# EAGLE design defmon (EAGLE 6.3)
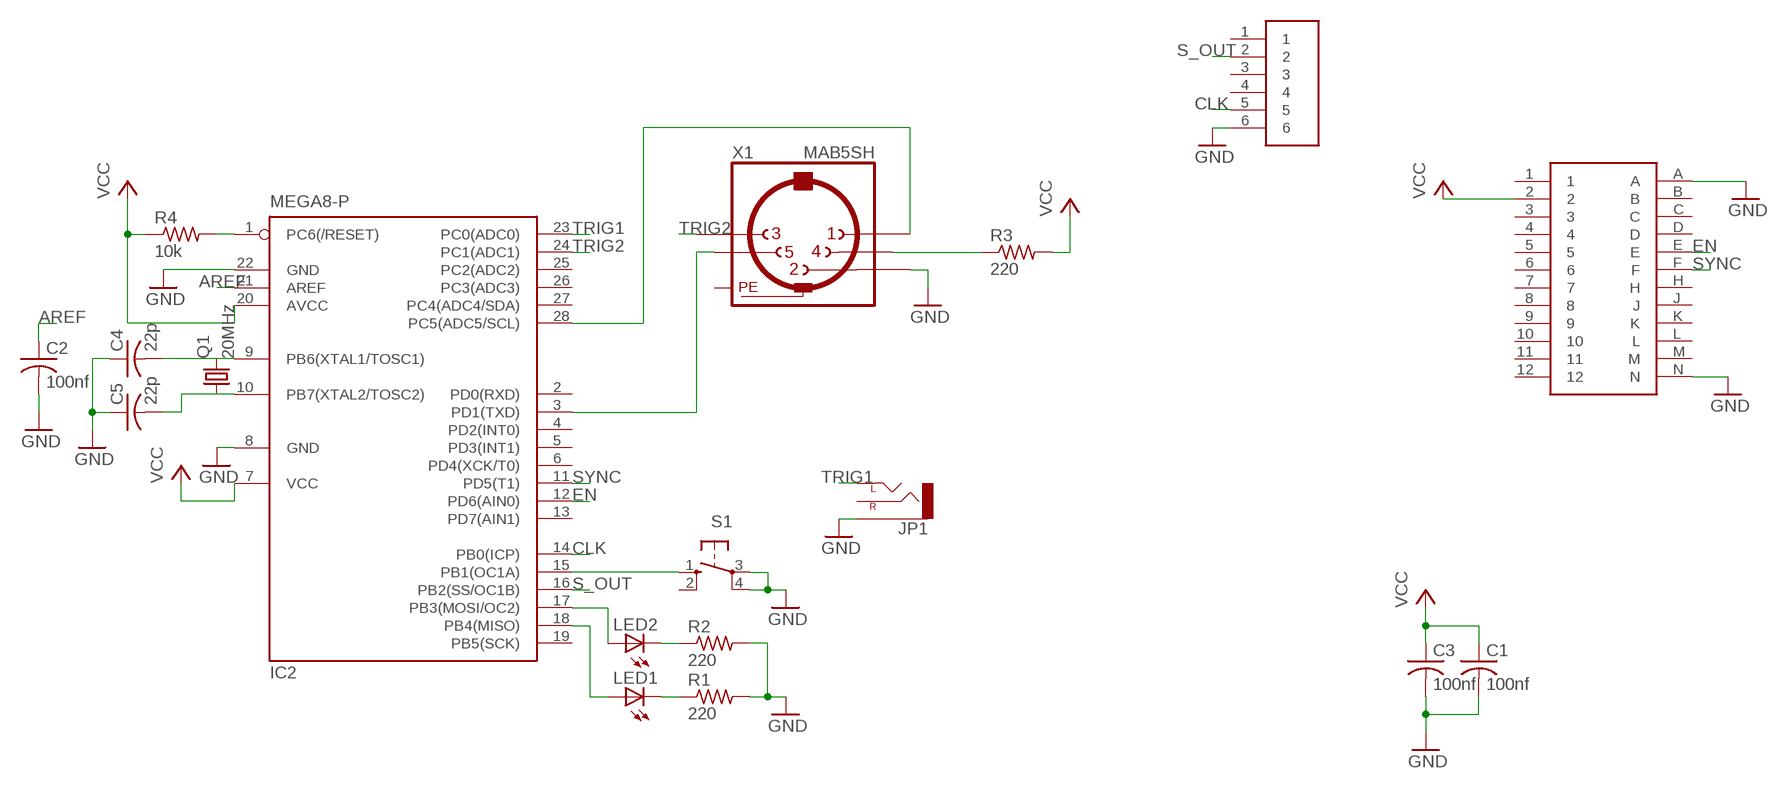
[diagram p0: schematic, sheet 1]

## Parts
C1  100nf  C-US025-025X050  [C025-025X050]
C2  100nf  C-US025-025X050  [C025-025X050]
C3  100nf  C-US025-025X050  [C025-025X050]
C4  22p  C-US025-025X050  [C025-025X050]
C5  22p  C-US025-025X050  [C025-025X050]
IC2  MEGA8-P  [DIL28-3]
JP1  AUDIO-JACKPTH  [AUDIO-JACK]
LED1  LED3MM  [LED3MM]
LED2  LED3MM  [LED3MM]
Q1  20MHz  CRYSTALHC49U-V  [HC49U-V]
R1  220  R-US_0204/7  [0204/7]
R2  220  R-US_0204/7  [0204/7]
R3  220  R-US_0204/7  [0204/7]
R4  10k  R-US_0204/7  [0204/7]
S1  40-XX  [B3F-40XX]
U$1  GB  [GB]
U$2  C64U  [C64U]
X1  MAB5SH  [MAB5SH]

## Nets
AREF: C2.1 IC2.21(AREF)
CLK: IC2.14(PB0(ICP)) U$1.5
EN: IC2.12(PD6(AIN0)) U$2.E
GND: C1.2 C2.2 C3.2 C4.1 C5.1 IC2.8(GND) IC2.22(GND) JP1.SLEEVE R1.2 R2.2 S1.3(P) S1.4(P1) U$1.6 U$2.A U$2.N X1.2
N$1: LED2.K(C) R2.1
N$2: LED1.K(C) R1.1
N$3: R3.1 X1.4
N$4: IC2.15(PB1(OC1A)) S1.1(S)
N$5: IC2.17(PB3(MOSI/OC2)) LED2.A
N$6: IC2.18(PB4(MISO)) LED1.A
N$8: C4.2 IC2.9(PB6(XTAL1/TOSC1)) Q1.2
N$9: IC2.28(PC5(ADC5/SCL)) X1.1
N$10: C1.1 C3.1 IC2.7(VCC) IC2.20(AVCC) R3.2 R4.1 U$2.2 ; supply symbol labelled VCC
N$11: C5.2 IC2.10(PB7(XTAL2/TOSC2)) Q1.1
N$12: IC2.1(PC6(/RESET)) R4.2
N$13: IC2.3(PD1(TXD)) X1.5
S_OUT: IC2.16(PB2(SS/OC1B)) U$1.2
SYNC: IC2.11(PD5(T1)) U$2.F
TRIG1: IC2.23(PC0(ADC0)) JP1.TIP(LEFT)
TRIG2: IC2.24(PC1(ADC1)) X1.3
Unconnected: IC2.2(PD0(RXD)) IC2.4(PD2(INT0)) IC2.5(PD3(INT1)) IC2.6(PD4(XCK/T0)) IC2.13(PD7(AIN1)) IC2.19(PB5(SCK)) IC2.25(PC2(ADC2)) IC2.26(PC3(ADC3)) IC2.27(PC4(ADC4/SDA)) JP1.RING(RIGHT) S1.2(S1) U$1.1 U$1.3 U$1.4 U$2.1 U$2.3 U$2.4 U$2.5 U$2.6 U$2.7 U$2.8 U$2.9 U$2.10 U$2.11 U$2.12 U$2.B U$2.C U$2.D U$2.H U$2.J U$2.K U$2.L U$2.M

## Power pins joined to a net without a drawn wire
PE: X1.PE X1.PE@(PE)

## Library data of the parts
C1-C5 = rcl:C-US: CAPACITOR, American symbol
IC2 = atmel:MEGA8-P: MICROCONTROLLER 8 Kbytes FLASH, 1 kbytes SRAM, 512 bytes EEPROM, USART, 4-channel 10 bit ADC, 2-channel 8 bit ADC Pin compatible with Atmega48, ATMega88, ATMega168 Source: avr.lbr; OC_FARNELL: unknown; OC_NEWARK: unknown
JP1 = SparkFun-Connectors:AUDIO-JACK: 3.5mm Audio Jack Simple 3.5mm common PCB mount audio jack. Variant PTH is our storefront SKU PRT-08032
LED1 LED2 = led:LED: LED OSRAM: - CHIPLED LG R971, LG N971, LY N971, LG Q971, LY Q971, LO R971, LY R971 LH N974, LH R974 LS Q976, LO Q976, LY Q976 LO Q996 - Hyper CHIPLED LW Q18S LB Q993, LB Q99A, LB R99A - SideLED LS A670, LO A670, LY A670, LG A670, LP A670 LB A673, LV A673, LT A673, LW A673 LH A674 LY A675 LS A676, LA A676, LO A676, LY A676, LW A676 LS A679, LY A679, LG A679 - Hyper Micro SIDELED® LS Y876, LA Y876, LO Y876, LY Y876 LT Y87S - SmartLED LW L88C, LW L88S LB L89C, LB L89S, LG L890 LS L89K, LO L89K, LY L89K LS L896, LA L896, LO L896, LY L896 - TOPLED LS T670, LO T670, LY T670, LG T670, LP T670 LSG T670, LSP T670, LSY T670, LOP T670, LYG T670 LG T671, LOG T671, LSG T671 LB T673, LV T673, LT T673, LW T673 LH T674 LS T676, LA T676, LO T676, LY T676, LB T676, LH T676, LSB T676, LW T676 LB T67C, LV T67C, LT T67C, LS T67K, LO T67K, LY T67K, LW E67C LS E67B, LA E67B, LO E67B, LY E67B, LB E67C, LV E67C, LT E67C LW T67C LS T679, LY T679, LG T679 LS T770, LO T770, LY T770, LG T770, LP T770 LB T773, LV T773, LT T773, LW T773 LH T774 LS E675, LA E675, LY E675, LS T675 LS T776, LA T776, LO T776, LY T776, LB T776 LHGB T686 LT T68C, LB T68C - Hyper Mini TOPLED® LB M676 - Mini TOPLED Santana® LG M470 LS M47K, LO M47K, LY M47K Source: http://www.osram.convergy.de LUXEON: - LUMILED® LXK2-PW12-R00, LXK2-PW12-S00, LXK2-PW14-U00, LXK2-PW14-V00 LXK2-PM12-R00, LXK2-PM12-S00, LXK2-PM14-U00 LXK2-PE12-Q00, LXK2-PE12-R00, LXK2-PE12-S00, LXK2-PE14-T00, LXK2-PE14-U00 LXK2-PB12-K00, LXK2-PB12-L00, LXK2-PB12-M00, LXK2-PB14-N00, LXK2-PB14-P00, LXK2-PB14-Q00 LXK2-PR12-L00, LXK2-PR12-M00, LXK2-PR14-Q00, LXK2-PR14-R00 LXK2-PD12-Q00, LXK2-PD12-R00, LXK2-PD12-S00 LXK2-PH12-R00, LXK2-PH12-S00 LXK2-PL12-P00, LXK2-PL12-Q00, LXK2-PL12-R00 Source: www.luxeon.com KINGBRIGHT: KA-3528ASYC Source: www.kingbright.com
Q1 = crystal:CRYSTAL: CRYSTAL; OC_FARNELL: 1666969; OC_NEWARK: unknown
R1-R4 = rcl:R-US_: RESISTOR, American symbol
S1 = switch-omron:40-XX: OMRON SWITCH; MF: OMRON COMPONENTS USA; MPN: B3F-4000; OC_FARNELL: 176434; OC_NEWARK: 36K3105
U$1 = connector:GB
U$2 = connector:C64U
X1 = con-hirschmann:MAB5SH: Female CONNECTOR 5 pins 90 deg. with shield, horizontal (DIN 41524); OC_FARNELL: 809883; OC_NEWARK: unknown

## Board
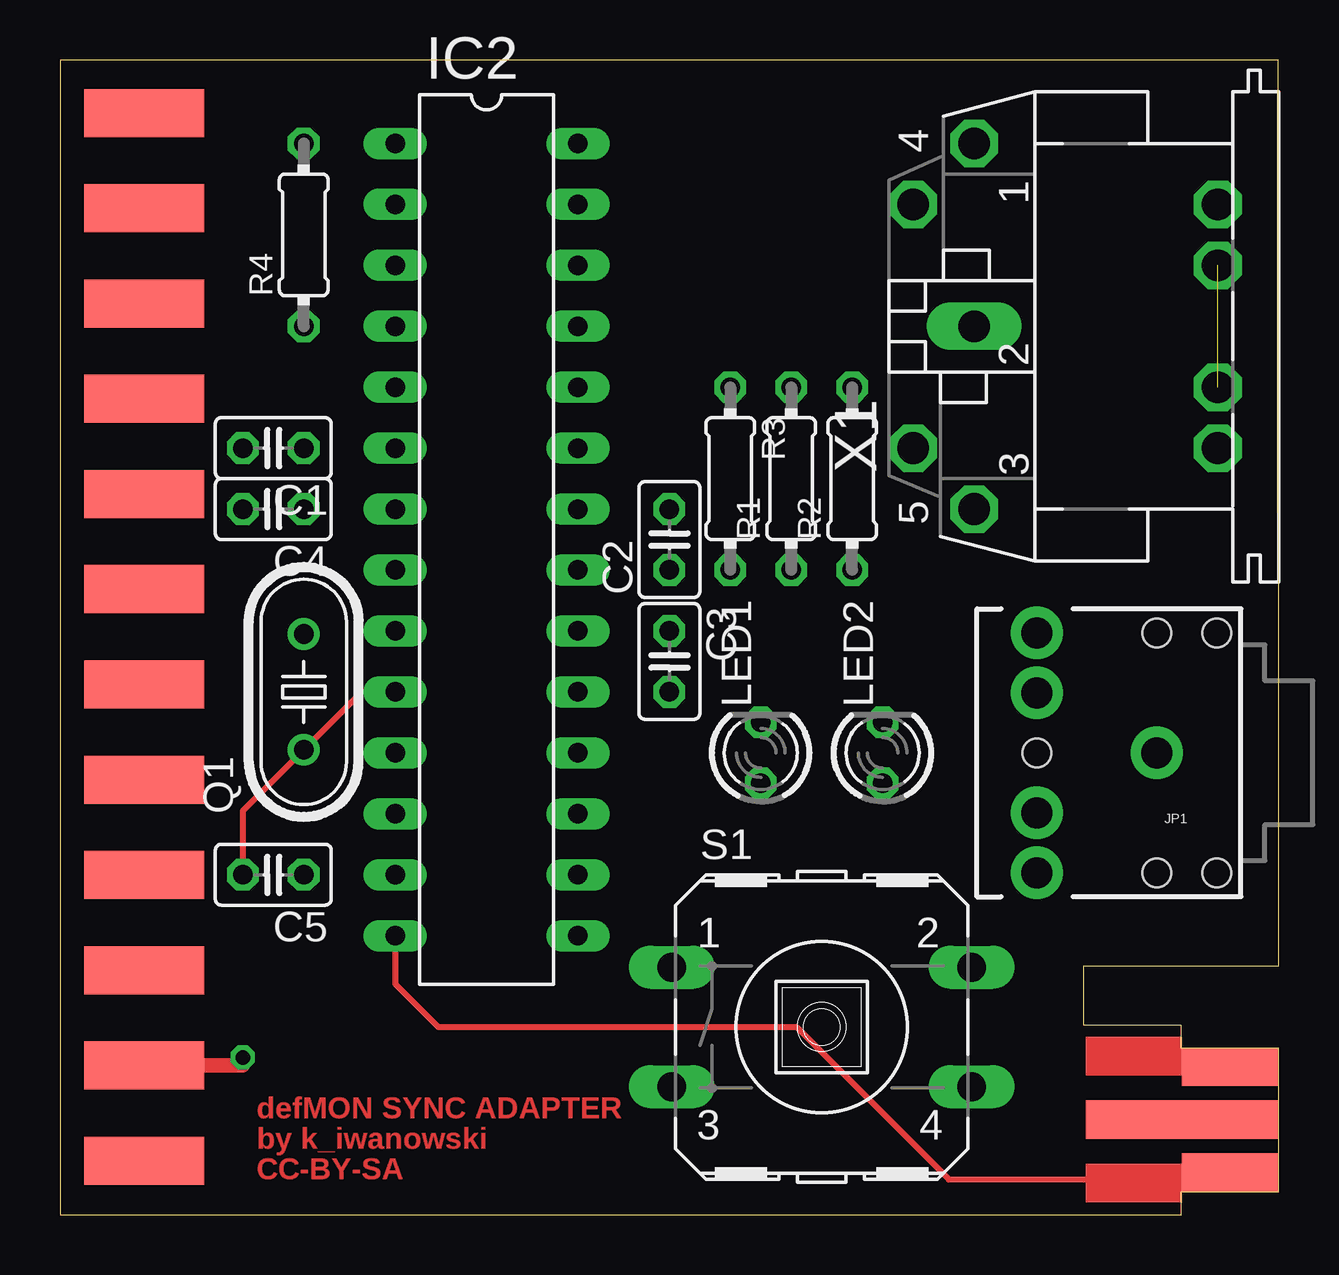
[diagram p1: board, top side]
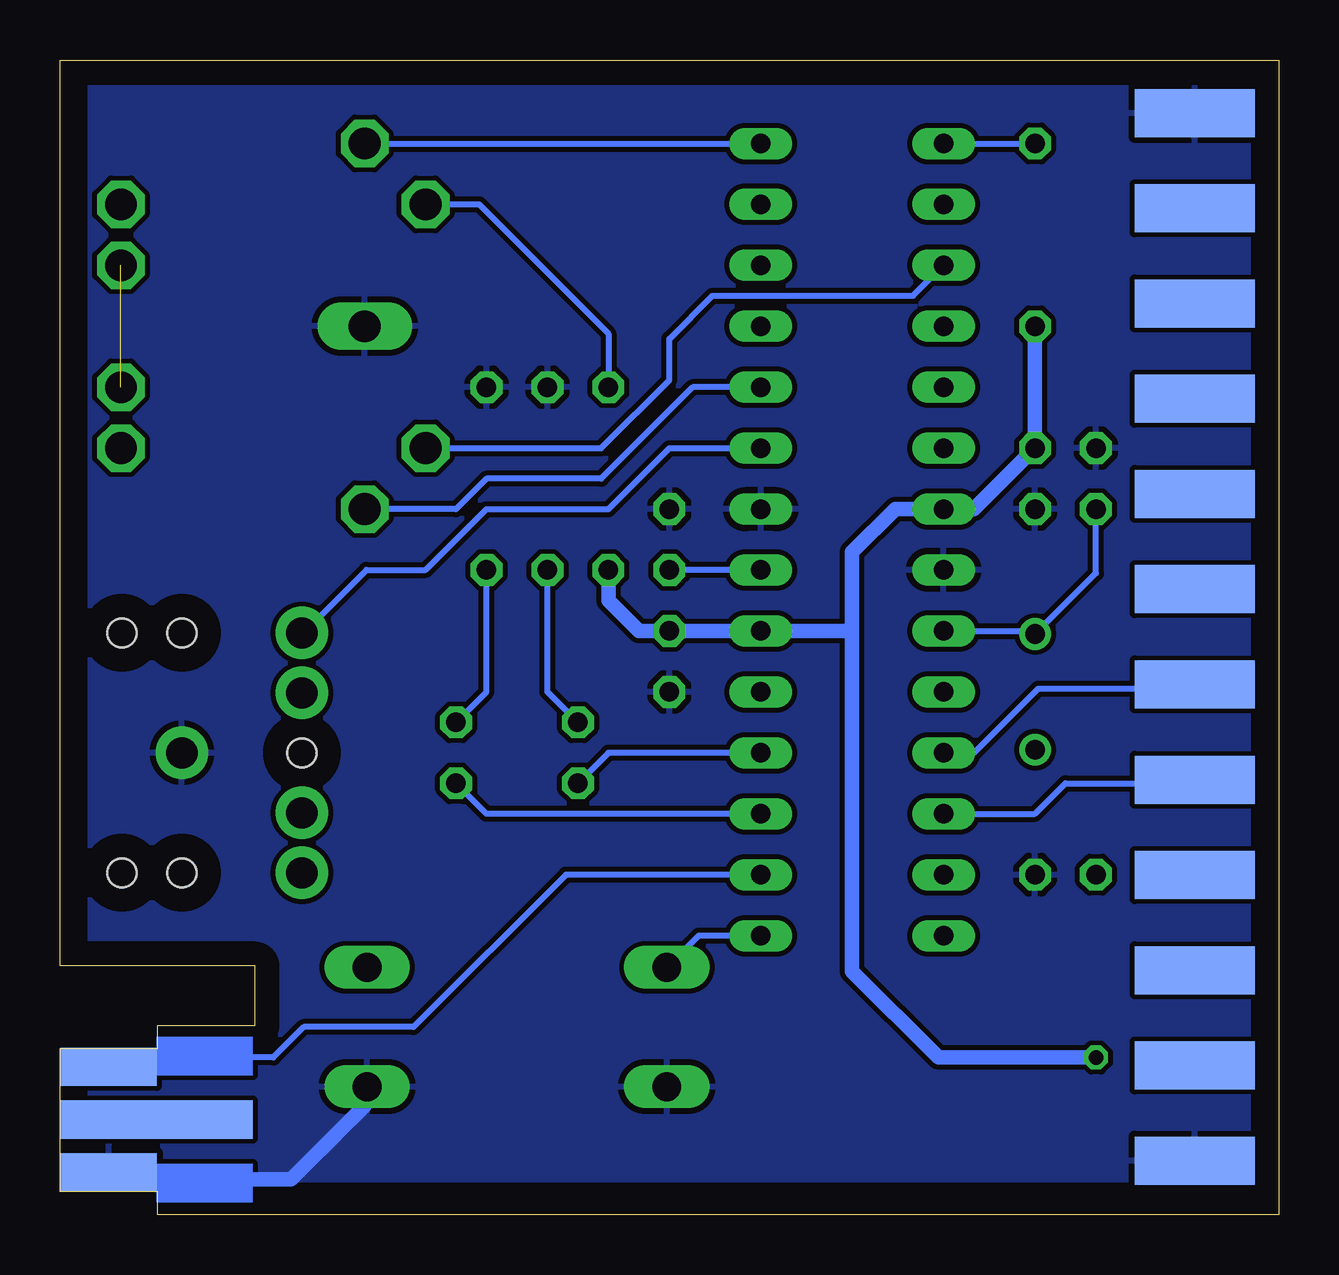
[diagram p2: board, bottom side, seen from below]

Size 50.8 x 48.13 mm. Coordinates in mm from the lower left corner, seen from the top.
Outline: 0,0 46.74,0 46.74,0.96 50.8,0.96 50.8,6.93 46.74,6.93 46.74,7.89 42.67,7.89 42.67,10.36 50.8,10.36 50.78,48.13 0,48.13 0,0
Copper layers (1*16): Top 0.035mm / dielectric 1.5mm / Bottom 0.035mm
Design rules "default": minimum track width 10mil, minimum drill 24mil, track to track 8mil, track to pad 8mil, pad to pad 8mil, via to via 8mil, smd to smd 8mil, copper to edge 40mil, drill to drill 8mil, minimum pad ring 10mil, minimum via ring 8mil, stop-mask expansion 4mil, vias tented up to drill 0mil, thermal gap 10mil

### Footprints (pad centres in the part's own frame; a part is rotated, then mirrored left to right if it is on the bottom)
C025-025X050 = drill 0.813 octagon: 1 -1.27,0; 2 1.27,0
DIL28-3 = drill 0.813 long: 1 -16.51,-3.81; 2 -13.97,-3.81; 3 -11.43,-3.81; 4 -8.89,-3.81; 5 -6.35,-3.81; 6 -3.81,-3.81; 7 -1.27,-3.81; 8 1.27,-3.81; 9 3.81,-3.81; 10 6.35,-3.81; 11 8.89,-3.81; 12 11.43,-3.81; 13 13.97,-3.81; 14 16.51,-3.81; 15 16.51,3.81; 16 13.97,3.81; 17 11.43,3.81; 18 8.89,3.81; 19 6.35,3.81; 20 3.81,3.81; 21 1.27,3.81; 22 -1.27,3.81; 23 -3.81,3.81; 24 -6.35,3.81; 25 -8.89,3.81; 26 -11.43,3.81; 27 -13.97,3.81; 28 -16.51,3.81
AUDIO-JACK = drill 1.3 pad 2.184: RING 5,5; RSH 5,2.5; SLEEVE 0,0; TIP 5,-5; TSH 5,-2.5 | hole 1.2: 0,5; -2.5,5; -2.5,-5; 0,-5; 5,0
LED3MM = drill 0.813 octagon: A -1.27,0; K 1.27,0
HC49U-V = drill 0.813: 1 -2.413,0; 2 2.413,0
0204/7 = drill 0.813 octagon: 1 -3.81,0; 2 3.81,0
B3F-40XX = drill 1.194 long: 1 -6.248,2.489; 2 6.248,2.489; 3 -6.248,-2.489; 4 6.248,-2.489
GB = smd 4 x 1.6: 1 0,5.2; 5 0,0.8 | smd 4 x 1.6 bottom: 2 0,5.2; 6 0,0.8 | smd 8 x 1.6: 3 -2,3 | smd 8 x 1.6 bottom: 4 -2,3
C64U = smd 5 x 2: 1 0,43.67; 2 0,39.7; 3 0,35.73; 4 0,31.76; 5 0,27.79; 6 0,23.82; 7 0,19.85; 8 0,15.88; 9 0,11.91; 10 0,7.94; 11 0,3.97; 12 0,0 | smd 5 x 2 bottom: A 0,43.67; B 0,39.7; C 0,35.73; D 0,31.76; E 0,27.79; F 0,23.82; H 0,19.85; J 0,15.88; K 0,11.91; L 0,7.94; M 0,3.97; N 0,0
MAB5SH = drill 1.321 octagon: 1 7.62,5.08; 3 -7.62,5.08; 4 5.08,7.62; 5 -5.08,7.62; PE -2.54,-5.08; PE1 -5.08,-5.08; PE2 5.08,-5.08; PE@ 2.54,-5.08 | drill 1.321 long: 2 0,5.08

### Placement (x,y rotation side)
C1  8.89,31.95 180 top
C2  25.4,28.14 90 top
C3  25.4,23.06 270 top
C4  8.89,29.41 180 top
C5  8.89,14.17 180 top
IC2  17.78,28.14 270 top
JP1  45.72,19.25 180 top
LED1  29.21,19.25 90 top
LED2  34.29,19.25 90 top
Q1  10.16,21.79 90 top
R1  30.48,30.68 90 top
R2  33.02,30.68 90 top
R3  27.94,30.68 270 top
R4  10.16,40.84 90 top
S1  31.75,7.82 0 top
U$1  48.77,0.96 0 top
U$2  3.5,45.92 180 top
X1  43.18,37.03 90 top

### Tracks (layer width: path | path; a pad name or v marks a point on that pad's centre or on a via)
AREF
  Bottom 0.254: IC2.21 C2.1
CLK
  Top 0.254: IC2.14 13.97,9.62 15.77,7.82 30.7,7.82 37.05,1.47 48.77,1.47 U$1.5
EN
  Bottom 0.254: IC2.12 10.16,16.71 8.89,17.98 3.81,17.98 U$2.E
GND
  Bottom 0.61: S1.4 38.1,5.33 38.1,4.54 41.17,1.47 48.77,1.47 U$1.6
  pour Bottom: 1.27,47.19 49.53,47.19 49.53,1.47 1.27,1.47
N$1
  Bottom 0.254: LED2.K 33.02,21.79 R2.1
N$2
  Bottom 0.254: LED1.K 30.48,21.79 R1.1
N$3
  Bottom 0.254: X1.4 33.33,42.11 27.94,36.72 R3.1
N$4
  Bottom 0.254: IC2.15 24.18,11.63 S1.1
N$5
  Bottom 0.254: IC2.17 33.02,16.71 LED2.A
N$6
  Bottom 0.254: IC2.18 27.94,19.25 LED1.A
N$8
  Bottom 0.254: IC2.9 10.16,24.33 Q1.2 7.62,26.74 C4.2
N$9
  Bottom 0.254: X1.1 IC2.28
N$10  (via drill 0.6)
  Top 0.61: U$2.2 7.62,6.22 v7.62,6.55
  Bottom 0.61: R3.2 27.94,25.6 26.67,24.33 C3.1 IC2.20 17.78,24.33 | 17.78,24.33 17.78,27.61 15.98,29.41 IC2.7 12.7,29.41 C1.1 R4.1 | v7.62,6.55 14.19,6.55 17.78,10.14 17.78,24.33
N$11
  Top 0.254: IC2.10 12.57,21.79 Q1.1 7.62,16.84 C5.2
N$12
  Bottom 0.254: IC2.1 R4.2
N$13
  Bottom 0.254: X1.5 28.24,31.95 25.4,34.79 25.4,36.5 23.6,38.3 15.24,38.3 IC2.3
PE  (1 unrouted)
S_OUT
  Bottom 0.254: IC2.16 29.71,14.17 36.06,7.82 40.64,7.82 41.91,6.55 48.77,6.55 U$1.2
SYNC
  Bottom 0.254: U$2.F 3.81,21.92 10.03,21.92 12.7,19.25 IC2.11
TRIG1
  Bottom 0.254: IC2.23 25.4,31.95 27.94,29.41 33.02,29.41 35.56,26.87 38.02,26.87 40.64,24.25 JP1.TIP
TRIG2
  Bottom 0.254: IC2.24 24.43,34.49 28.24,30.68 33.02,30.68 34.29,29.41 X1.3

### Text on the board
Top: defMON SYNC ADAPTER | by k_iwanowski | CC-BY-SA
tStop: defMON SYNC ADAPTER | by k_iwanowski | CC-BY-SA